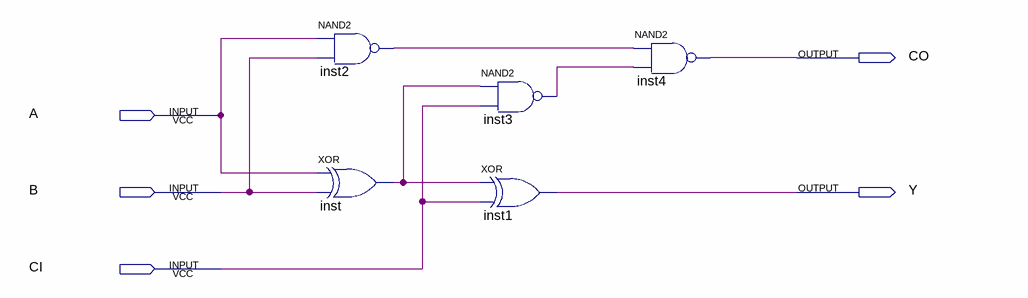
[diagram p0: schematic sheet]
// Quartus schematic sum1.bdf as structural Verilog: 5 symbols, 5 pins
module sum1 (
  input  A,
  input  B,
  input  CI,
  output CO,
  output Y
);

  wire inst2_out, inst3_out, inst_out;

  nand inst2 (inst2_out, A, B);
  xor inst (inst_out, A, B);
  nand inst3 (inst3_out, inst_out, CI);
  xor inst1 (Y, inst_out, CI);
  nand inst4 (CO, inst2_out, inst3_out);
endmodule
